# EAGLE schematic schema esp01-chata (EAGLE 6.5.0)
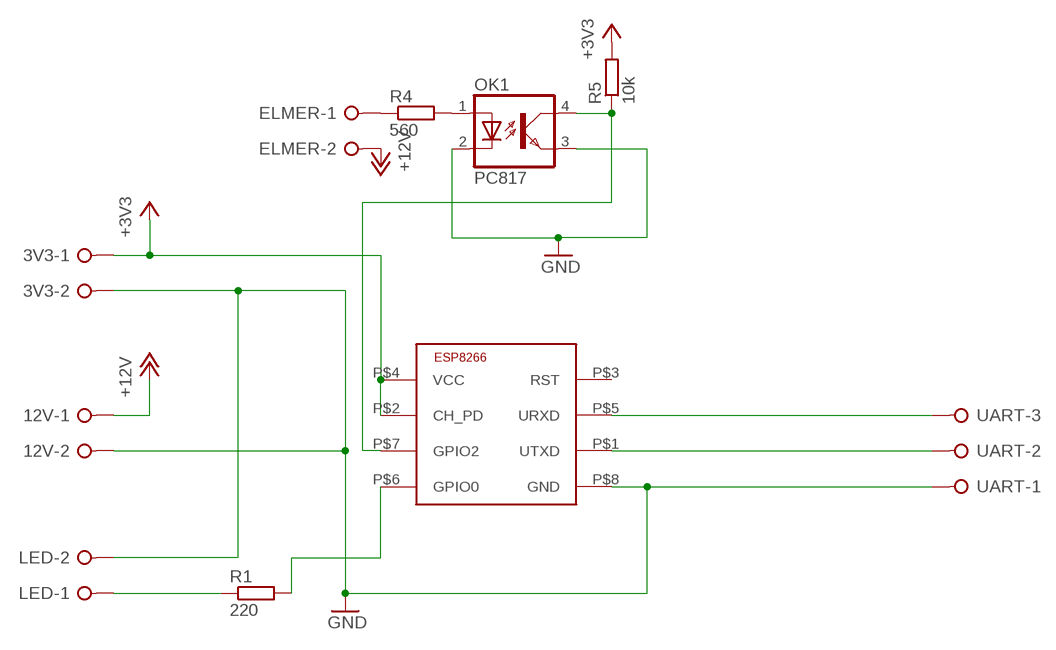
[diagram p0: schematic, sheet 1]

## Parts
3V3  W237-02P  [W237-132]
12V  W237-02P  [W237-132]
ELMER  W237-02P  [W237-132]
LED  W237-02P  [W237-132]
OK1  PC817  [DIL04]
R1  220  R-EU_0204/7  [0204/7]
R4  560  R-EU_0204/7  [0204/7]
R5  10k  R-EU_0204/7  [0204/7]
U$1  ESP8266-01  [ESP-01]
UART  W237-3E  [W237-3E]

## Nets
+3V3: 3V3.1 R5.2 U$1.P$2(CH_PD) U$1.P$4(VCC)
+12V: 12V.1 ELMER.2
GND: 3V3.2 12V.2 LED.2 OK1.2(C) OK1.3(EMIT) U$1.P$8(GND) UART.1
N$2: LED.1 R1.1
N$3: R1.2 U$1.P$6(GPIO0)
N$4: OK1.1(A) R4.2
N$5: U$1.P$5(URXD) UART.3
N$6: U$1.P$1(UTXD) UART.2
N$7: OK1.4(COL) R5.1 U$1.P$7(GPIO2)
N$8: ELMER.1 R4.1
Unconnected: U$1.P$3(RST)

## Library data of the parts
3V3 12V ELMER LED = con-wago-508:W237-02P: WAGO SREW CLAMP; OC_FARNELL: unknown; OC_NEWARK: unknown
OK1 = optocoupler:PC817: SHARP OPTO COUPLER; MPN: PC817X4J000F; OC_FARNELL: 9707727; OC_NEWARK: 97K7059
R1 R4 R5 = rcl:R-EU_: RESISTOR, European symbol
U$1 = ESP8266:ESP8266-01: ESP8266 - ESP-01 Module
UART = con-wago-508:W237-3E: WAGO SREW CLAMP; OC_FARNELL: unknown; OC_NEWARK: unknown